# Altium schematic sheet Main_LEDs.SchDoc: MAIN / LEDs
size A3; Author: Davide Bortolami; DocumentNumber: 2; SheetNumber: 2; SheetTotal: 2
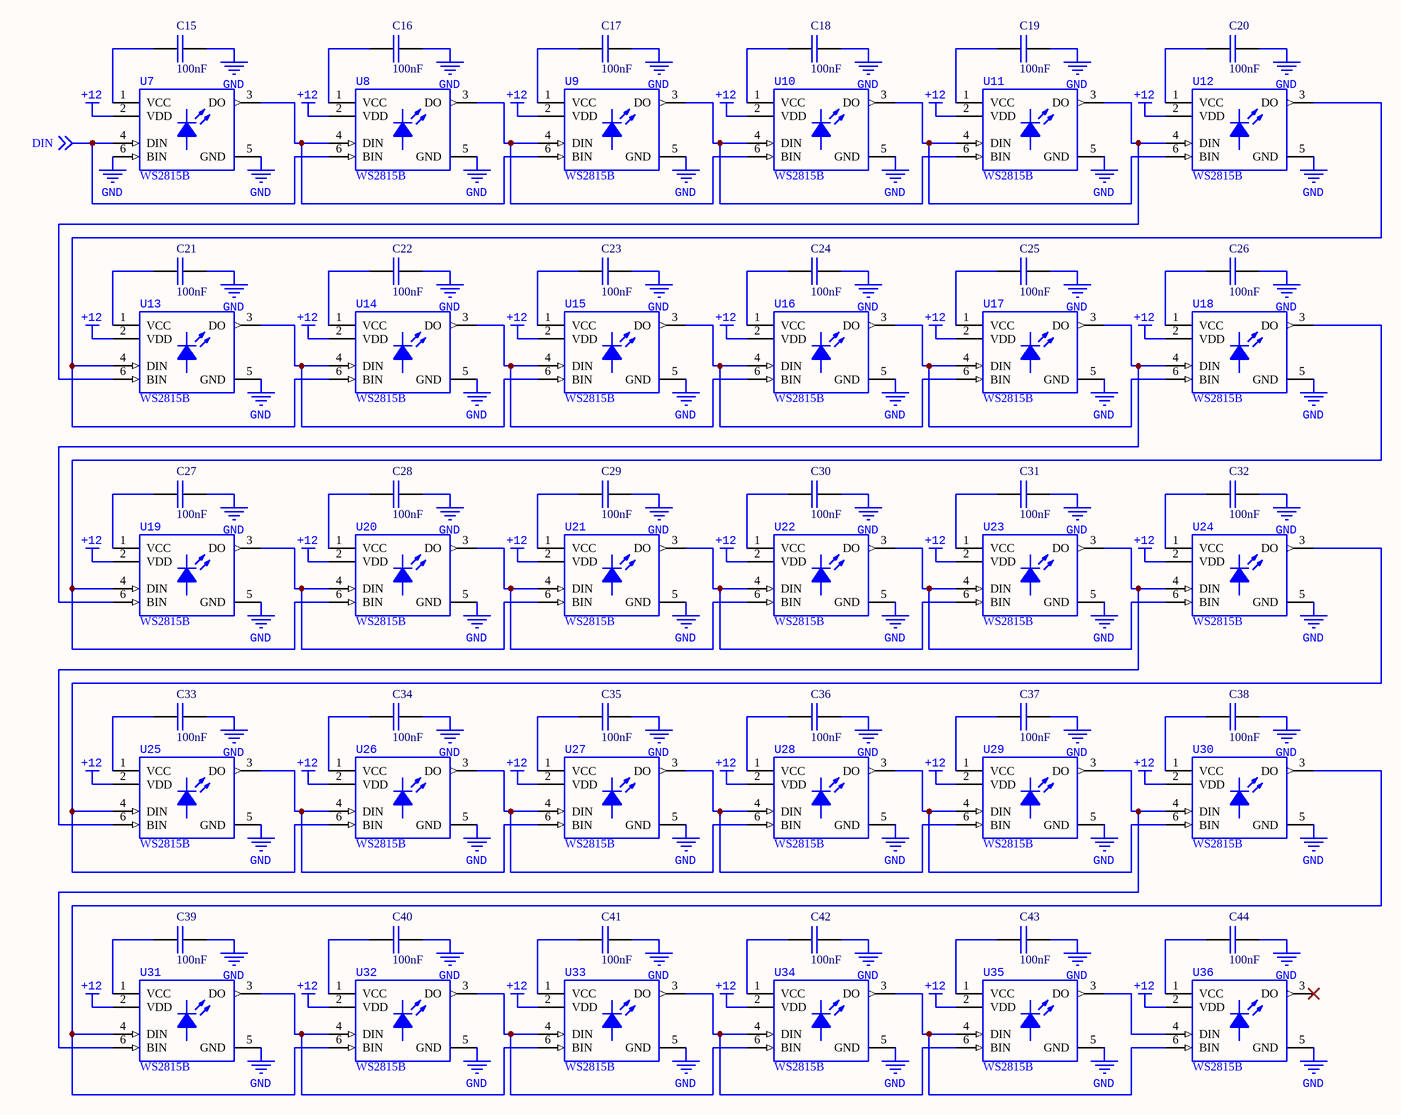
[diagram p0: Main_LEDs.SchDoc]

## Parts
C15  100nF  [CAP 0603_1608]
C16  100nF  [CAP 0603_1608]
C17  100nF  [CAP 0603_1608]
C18  100nF  [CAP 0603_1608]
C19  100nF  [CAP 0603_1608]
C20  100nF  [CAP 0603_1608]
C21  100nF  [CAP 0603_1608]
C22  100nF  [CAP 0603_1608]
C23  100nF  [CAP 0603_1608]
C24  100nF  [CAP 0603_1608]
C25  100nF  [CAP 0603_1608]
C26  100nF  [CAP 0603_1608]
C27  100nF  [CAP 0603_1608]
C28  100nF  [CAP 0603_1608]
C29  100nF  [CAP 0603_1608]
C30  100nF  [CAP 0603_1608]
C31  100nF  [CAP 0603_1608]
C32  100nF  [CAP 0603_1608]
C33  100nF  [CAP 0603_1608]
C34  100nF  [CAP 0603_1608]
C35  100nF  [CAP 0603_1608]
C36  100nF  [CAP 0603_1608]
C37  100nF  [CAP 0603_1608]
C38  100nF  [CAP 0603_1608]
C39  100nF  [CAP 0603_1608]
C40  100nF  [CAP 0603_1608]
C41  100nF  [CAP 0603_1608]
C42  100nF  [CAP 0603_1608]
C43  100nF  [CAP 0603_1608]
C44  100nF  [CAP 0603_1608]
U7  WS2815B  [255a589e-2ba4-4b32-b6dc-1eb723808ff2]
U8  WS2815B  [255a589e-2ba4-4b32-b6dc-1eb723808ff2]
U9  WS2815B  [255a589e-2ba4-4b32-b6dc-1eb723808ff2]
U10  WS2815B  [255a589e-2ba4-4b32-b6dc-1eb723808ff2]
U11  WS2815B  [255a589e-2ba4-4b32-b6dc-1eb723808ff2]
U12  WS2815B  [255a589e-2ba4-4b32-b6dc-1eb723808ff2]
U13  WS2815B  [255a589e-2ba4-4b32-b6dc-1eb723808ff2]
U14  WS2815B  [255a589e-2ba4-4b32-b6dc-1eb723808ff2]
U15  WS2815B  [255a589e-2ba4-4b32-b6dc-1eb723808ff2]
U16  WS2815B  [255a589e-2ba4-4b32-b6dc-1eb723808ff2]
U17  WS2815B  [255a589e-2ba4-4b32-b6dc-1eb723808ff2]
U18  WS2815B  [255a589e-2ba4-4b32-b6dc-1eb723808ff2]
U19  WS2815B  [255a589e-2ba4-4b32-b6dc-1eb723808ff2]
U20  WS2815B  [255a589e-2ba4-4b32-b6dc-1eb723808ff2]
U21  WS2815B  [255a589e-2ba4-4b32-b6dc-1eb723808ff2]
U22  WS2815B  [255a589e-2ba4-4b32-b6dc-1eb723808ff2]
U23  WS2815B  [255a589e-2ba4-4b32-b6dc-1eb723808ff2]
U24  WS2815B  [255a589e-2ba4-4b32-b6dc-1eb723808ff2]
U25  WS2815B  [255a589e-2ba4-4b32-b6dc-1eb723808ff2]
U26  WS2815B  [255a589e-2ba4-4b32-b6dc-1eb723808ff2]
U27  WS2815B  [255a589e-2ba4-4b32-b6dc-1eb723808ff2]
U28  WS2815B  [255a589e-2ba4-4b32-b6dc-1eb723808ff2]
U29  WS2815B  [255a589e-2ba4-4b32-b6dc-1eb723808ff2]
U30  WS2815B  [255a589e-2ba4-4b32-b6dc-1eb723808ff2]
U31  WS2815B  [255a589e-2ba4-4b32-b6dc-1eb723808ff2]
U32  WS2815B  [255a589e-2ba4-4b32-b6dc-1eb723808ff2]
U33  WS2815B  [255a589e-2ba4-4b32-b6dc-1eb723808ff2]
U34  WS2815B  [255a589e-2ba4-4b32-b6dc-1eb723808ff2]
U35  WS2815B  [255a589e-2ba4-4b32-b6dc-1eb723808ff2]
U36  WS2815B  [255a589e-2ba4-4b32-b6dc-1eb723808ff2]

## Nets
+12: U7.2(VDD) U8.2(VDD) U9.2(VDD) U10.2(VDD) U11.2(VDD) U12.2(VDD) U13.2(VDD) U14.2(VDD) U15.2(VDD) U16.2(VDD) U17.2(VDD) U18.2(VDD) U19.2(VDD) U20.2(VDD) U21.2(VDD) U22.2(VDD) U23.2(VDD) U24.2(VDD) U25.2(VDD) U26.2(VDD) U27.2(VDD) U28.2(VDD) U29.2(VDD) U30.2(VDD) U31.2(VDD) U32.2(VDD) U33.2(VDD) U34.2(VDD) U35.2(VDD) U36.2(VDD)
GND: C15.2 C16.2 C17.2 C18.2 C19.2 C20.2 C21.2 C22.2 C23.2 C24.2 C25.2 C26.2 C27.2 C28.2 C29.2 C30.2 C31.2 C32.2 C33.2 C34.2 C35.2 C36.2 C37.2 C38.2 C39.2 C40.2 C41.2 C42.2 C43.2 C44.2 U7.5(GND) U7.6(BIN) U8.5(GND) U9.5(GND) U10.5(GND) U11.5(GND) U12.5(GND) U13.5(GND) U14.5(GND) U15.5(GND) U16.5(GND) U17.5(GND) U18.5(GND) U19.5(GND) U20.5(GND) U21.5(GND) U22.5(GND) U23.5(GND) U24.5(GND) U25.5(GND) U26.5(GND) U27.5(GND) U28.5(GND) U29.5(GND) U30.5(GND) U31.5(GND) U32.5(GND) U33.5(GND) U34.5(GND) U35.5(GND) U36.5(GND)
DIN: U7.4(DIN) U8.6(BIN) ; off-sheet DIN
NetC15_1: C15.1 U7.1(VCC)
NetC16_1: C16.1 U8.1(VCC)
NetC17_1: C17.1 U9.1(VCC)
NetC18_1: C18.1 U10.1(VCC)
NetC19_1: C19.1 U11.1(VCC)
NetC20_1: C20.1 U12.1(VCC)
NetC21_1: C21.1 U13.1(VCC)
NetC22_1: C22.1 U14.1(VCC)
NetC23_1: C23.1 U15.1(VCC)
NetC24_1: C24.1 U16.1(VCC)
NetC25_1: C25.1 U17.1(VCC)
NetC26_1: C26.1 U18.1(VCC)
NetC27_1: C27.1 U19.1(VCC)
NetC28_1: C28.1 U20.1(VCC)
NetC29_1: C29.1 U21.1(VCC)
NetC30_1: C30.1 U22.1(VCC)
NetC31_1: C31.1 U23.1(VCC)
NetC32_1: C32.1 U24.1(VCC)
NetC33_1: C33.1 U25.1(VCC)
NetC34_1: C34.1 U26.1(VCC)
NetC35_1: C35.1 U27.1(VCC)
NetC36_1: C36.1 U28.1(VCC)
NetC37_1: C37.1 U29.1(VCC)
NetC38_1: C38.1 U30.1(VCC)
NetC39_1: C39.1 U31.1(VCC)
NetC40_1: C40.1 U32.1(VCC)
NetC41_1: C41.1 U33.1(VCC)
NetC42_1: C42.1 U34.1(VCC)
NetC43_1: C43.1 U35.1(VCC)
NetC44_1: C44.1 U36.1(VCC)
NetU7_3: U7.3(DO) U8.4(DIN) U9.6(BIN)
NetU8_3: U8.3(DO) U9.4(DIN) U10.6(BIN)
NetU9_3: U9.3(DO) U10.4(DIN) U11.6(BIN)
NetU10_3: U10.3(DO) U11.4(DIN) U12.6(BIN)
NetU11_3: U11.3(DO) U12.4(DIN) U13.6(BIN)
NetU12_3: U12.3(DO) U13.4(DIN) U14.6(BIN)
NetU13_3: U13.3(DO) U14.4(DIN) U15.6(BIN)
NetU14_3: U14.3(DO) U15.4(DIN) U16.6(BIN)
NetU15_3: U15.3(DO) U16.4(DIN) U17.6(BIN)
NetU16_3: U16.3(DO) U17.4(DIN) U18.6(BIN)
NetU17_3: U17.3(DO) U18.4(DIN) U19.6(BIN)
NetU18_3: U18.3(DO) U19.4(DIN) U20.6(BIN)
NetU19_3: U19.3(DO) U20.4(DIN) U21.6(BIN)
NetU20_3: U20.3(DO) U21.4(DIN) U22.6(BIN)
NetU21_3: U21.3(DO) U22.4(DIN) U23.6(BIN)
NetU22_3: U22.3(DO) U23.4(DIN) U24.6(BIN)
NetU23_3: U23.3(DO) U24.4(DIN) U25.6(BIN)
NetU24_3: U24.3(DO) U25.4(DIN) U26.6(BIN)
NetU25_3: U25.3(DO) U26.4(DIN) U27.6(BIN)
NetU26_3: U26.3(DO) U27.4(DIN) U28.6(BIN)
NetU27_3: U27.3(DO) U28.4(DIN) U29.6(BIN)
NetU28_3: U28.3(DO) U29.4(DIN) U30.6(BIN)
NetU29_3: U29.3(DO) U30.4(DIN) U31.6(BIN)
NetU30_3: U30.3(DO) U31.4(DIN) U32.6(BIN)
NetU31_3: U31.3(DO) U32.4(DIN) U33.6(BIN)
NetU32_3: U32.3(DO) U33.4(DIN) U34.6(BIN)
NetU33_3: U33.3(DO) U34.4(DIN) U35.6(BIN)
NetU34_3: U34.3(DO) U35.4(DIN) U36.6(BIN)
NetU35_3: U35.3(DO) U36.4(DIN)

Not connected (* = marked no-connect by the designer): U36 3(DO)*

## Notes on the sheet
- Title:
- Author:
- Approved:
- Fermium LTD
- Size:
- Date:
- Git Hash:
- A4
- Prj:
- SW Version:
- Variant:
- Edited:
- CONFIDENTIAL
- 71-75 Shelton Street
- London
- WC2H 9JQ
- fermium.ltd.uk <http://fermium.ltd.uk>
- File:

## Library data of the parts
C15-C44 = 02841f84-ac15-41b5-9e17-915f8f067828: CAP SMD MLCC 100nF 25V 0603 X7R; Manufacturer 1: Samsung Electro-Mechanics; Manufacturer Part Number 1: CL10B104KA8NNNC; id: 14784; S 1: LCSC; SPN 1: C14663; SPN 2: C1590; Part Number: 02841f84-ac15-41b5-9e17-915f8f067828; ComponentLink1Description: Datasheet; ComponentLink1URL: http://localhost:8080/static/files/Samsung-Electro-Mechanics-CL10B104KA8NNNC_C15902019-03-10_215548.826887.pdf?Samsung-Electro-Mechanics-CL10B104KA8NNNC_C1590.pdf; Manufacturer 2: Yageo; Manufacturer Part Number 2: CC0603KRX7R9BB104; S 2: LCSC; Value: 100nF
U7-U36 = 6f697cdb-93d0-46fc-8e29-f2cd6d395cf4: IC SMD LED RGB DIGITAL 12V WS2815B; Manufacturer 1: Worldsemi; id: 14859; S 1: TME; Part Number: 6f697cdb-93d0-46fc-8e29-f2cd6d395cf4; ComponentLink1Description: Datasheet; ComponentLink1URL: http://localhost:8080/static/files/WS2815B2020-10-20_115024.135885.pdf?WS2815B.pdf; Manufacturer Part Number 1: WS2815B; SPN 1: WS2815B